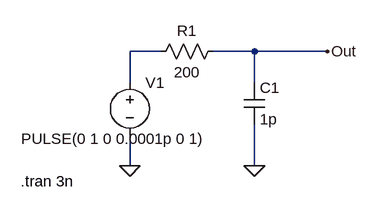
[diagram p0: schematic Draft5.asc]
Draft5.asc, the LTspice schematic file:
Version 4
SHEET 1 880 680
WIRE 128 112 80 112
WIRE 272 112 208 112
WIRE 384 112 272 112
WIRE 80 160 80 112
WIRE 272 160 272 112
WIRE 80 288 80 240
WIRE 272 288 272 224
FLAG 272 288 0
FLAG 80 288 0
FLAG 384 112 Out
SYMBOL res 224 96 R90
WINDOW 0 0 56 VBottom 2
WINDOW 3 32 56 VTop 2
SYMATTR InstName R1
SYMATTR Value 200
SYMBOL voltage 80 144 R0
WINDOW 3 -167 102 Left 2
WINDOW 123 0 0 Left 0
WINDOW 39 0 0 Left 0
SYMATTR InstName V1
SYMATTR Value PULSE(0 1 0 0.0001p 0 1)
SYMBOL cap 256 160 R0
SYMATTR InstName C1
SYMATTR Value 1p
TEXT -88 312 Left 2 !.tran 3n

The netlist it stands for:
* Draft5.asc
R1 Out N001 200
V1 N001 0 PULSE(0 1 0 0.0001p 0 1)
C1 Out 0 1p
.tran 3n
.backanno
.end